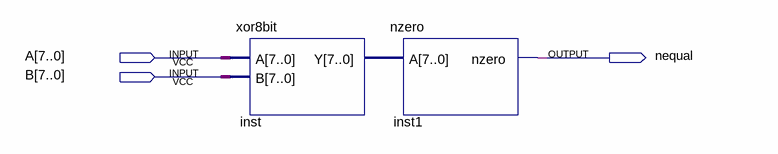
[diagram p0: schematic sheet]
// Quartus schematic nequal.bdf as structural Verilog: 2 symbols, 3 pins
module nequal (
  input  [7:0] A,
  input  [7:0] B,
  output nequal
);

  wire [7:0] inst_y;

  xor8bit inst (.A(A), .B(B), .Y(inst_y));
  nzero inst1 (.A(inst_y), .nzero(nequal));
endmodule
